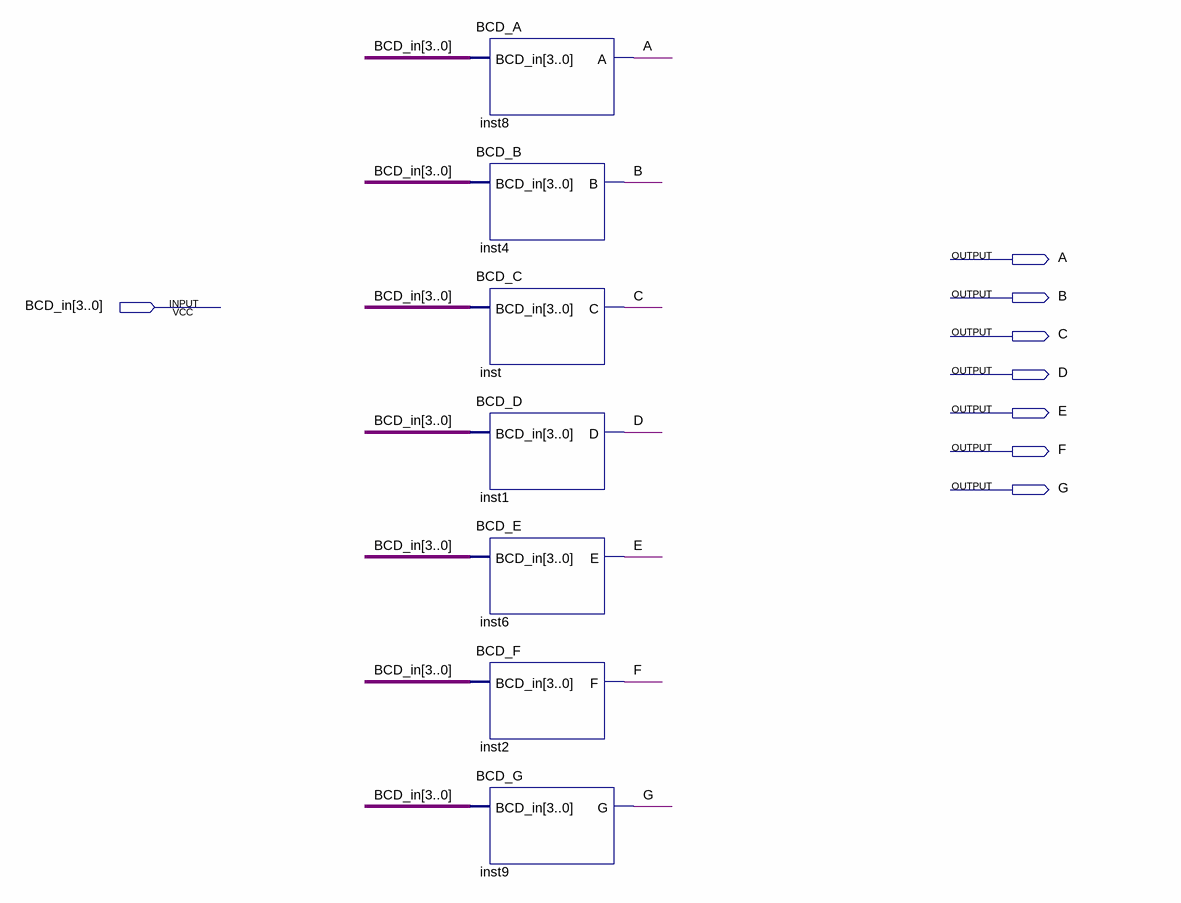
[diagram p0: schematic sheet]
// Quartus schematic BCD_7seg.bdf as structural Verilog: 7 symbols, 8 pins
module BCD_7seg (
  input  [3:0] BCD_in,
  output A,
  output B,
  output C,
  output D,
  output E,
  output F,
  output G
);

  BCD_A inst8 (.BCD_in(BCD_in), .A(A));
  BCD_B inst4 (.BCD_in(BCD_in), .B(B));
  BCD_C inst (.BCD_in(BCD_in), .C(C));
  BCD_D inst1 (.BCD_in(BCD_in), .D(D));
  BCD_E inst6 (.BCD_in(BCD_in), .E(E));
  BCD_F inst2 (.BCD_in(BCD_in), .F(F));
  BCD_G inst9 (.BCD_in(BCD_in), .G(G));
endmodule
